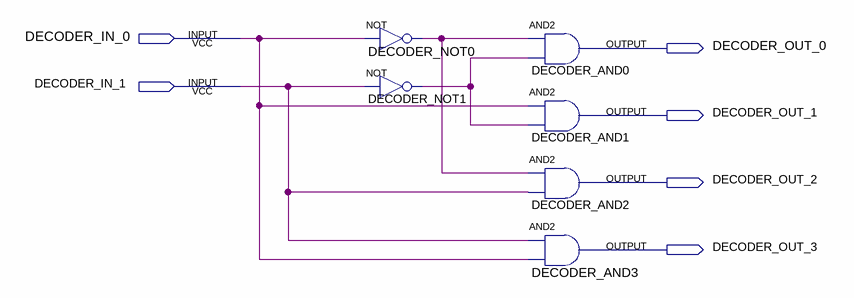
[diagram p0: schematic sheet]
// Quartus schematic decoder24.bdf as structural Verilog: 6 symbols, 6 pins
module decoder24 (
  input  DECODER_IN_0,
  input  DECODER_IN_1,
  output DECODER_OUT_0,
  output DECODER_OUT_1,
  output DECODER_OUT_2,
  output DECODER_OUT_3
);

  wire DECODER_NOT0_out, DECODER_NOT1_out;

  not DECODER_NOT0 (DECODER_NOT0_out, DECODER_IN_0);
  not DECODER_NOT1 (DECODER_NOT1_out, DECODER_IN_1);
  and DECODER_AND0 (DECODER_OUT_0, DECODER_NOT0_out, DECODER_NOT1_out);
  and DECODER_AND1 (DECODER_OUT_1, DECODER_IN_0, DECODER_NOT1_out);
  and DECODER_AND2 (DECODER_OUT_2, DECODER_NOT0_out, DECODER_IN_1);
  and DECODER_AND3 (DECODER_OUT_3, DECODER_IN_1, DECODER_IN_0);
endmodule
